# EAGLE design EE02CO2Sensor (EAGLE 7.6.0)
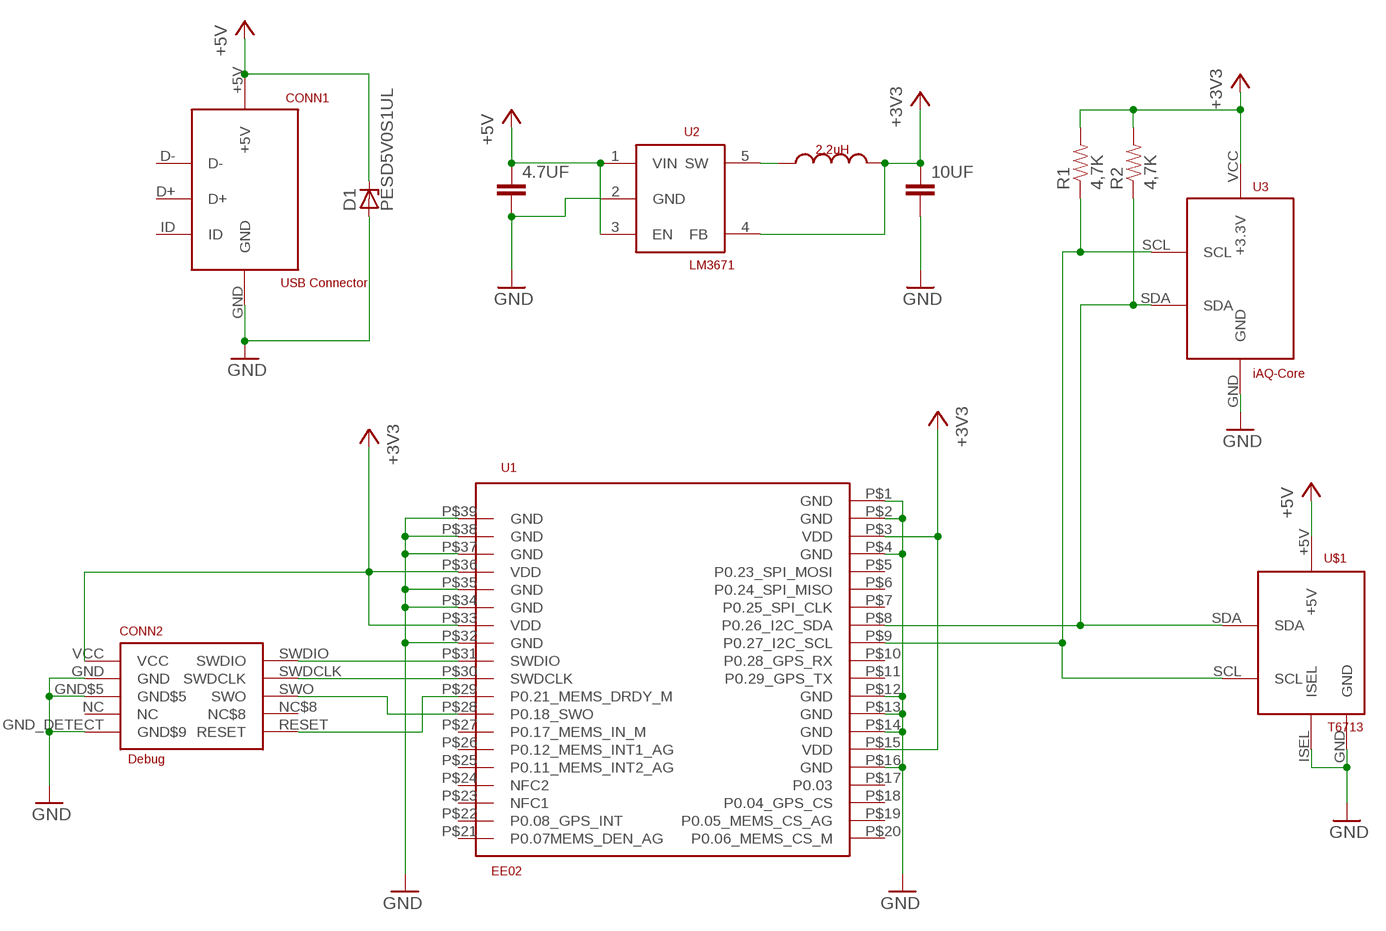
[diagram p0: schematic, sheet 1]

## Parts
4.7UF  4.7UF-0805  [0805]
10UF  10UF-1206  [1206]
CONN1  USB Connector  USB_MICRO_B  [USB_MICRO_B]
CONN2  Debug  DEBUGHEADER  [NRF52-P19-CONNECTOR]
D1  PESD5V0S1UL  [SOD882]
I1  2.2uH  2.2UH-INDUCTOR-1210  [1210]
R1  4,7K  510OHM1/4W1%(0805)  [0805]
R2  4,7K  510OHM1/4W1%(0805)  [0805]
U1  EE02  [EE02]
U2  LM3671  [SOT23-5L]
U3  iAQ-Core  IAQ-CORE  [IAQ-CORE]
U$1  T6713  T6713CO2  [T6713CO2]

## Nets
+3V3: 10UF.1 CONN2.VCC I1.2 R1.2 R2.2 U1.P$3(VDD) U1.P$15(VDD) U1.P$33(VDD) U1.P$36(VDD) U2.4(FB) U3.VCC(+3.3V)
+5V: 4.7UF.1 CONN1.+5V D1.CATHODE(C) U2.1(VIN) U2.3(EN) U$1.+5V
GND: 4.7UF.2 10UF.2 CONN1.GND CONN2.GND CONN2.GND$5 CONN2.GND_DETECT(GND$9) D1.ANODE(A) U1.P$1(GND) U1.P$2(GND) U1.P$4(GND) U1.P$12(GND) U1.P$13(GND) U1.P$14(GND) U1.P$16(GND) U1.P$32(GND) U1.P$34(GND) U1.P$35(GND) U1.P$37(GND) U1.P$38(GND) U1.P$39(GND) U2.2(GND) U3.GND U$1.GND U$1.ISEL
N$1: I1.1 U2.5(SW)
N$4: R2.1 U1.P$8(P0.26_I2C_SDA) U3.SDA U$1.SDA
N$5: R1.1 U1.P$9(P0.27_I2C_SCL) U3.SCL U$1.SCL
N$6: CONN2.SWDIO U1.P$31(SWDIO)
N$7: CONN2.SWO U1.P$28(P0.18_SWO)
N$8: CONN2.SWDCLK U1.P$30(SWDCLK)
N$9: CONN2.RESET U1.P$29(P0.21_MEMS_DRDY_M)
Unconnected: CONN1.D+ CONN1.D- CONN1.ID CONN2.NC CONN2.NC$8 U1.P$5(P0.23_SPI_MOSI) U1.P$6(P0.24_SPI_MISO) U1.P$7(P0.25_SPI_CLK) U1.P$10(P0.28_GPS_RX) U1.P$11(P0.29_GPS_TX) U1.P$17(P0.03) U1.P$18(P0.04_GPS_CS) U1.P$19(P0.05_MEMS_CS_AG) U1.P$20(P0.06_MEMS_CS_M) U1.P$21(P0.07MEMS_DEN_AG) U1.P$22(P0.08_GPS_INT) U1.P$23(NFC1) U1.P$24(NFC2) U1.P$25(P0.11_MEMS_INT2_AG) U1.P$26(P0.12_MEMS_INT1_AG) U1.P$27(P0.17_MEMS_IN_M)

## Library data of the parts
4.7UF = EE:4.7UF-0805
10UF = EE:10UF-1206: 10uF
CONN1 = EE:USB_MICRO_B
CONN2 = EE:DEBUGHEADER: DEBUG HEADER
D1 = EE:PESD5V0S1UL: Unidirectional ESD protection diode; VALE: PESD5V0S1UL
I1 = EE:2.2UH-INDUCTOR-1210
R1 R2 = EE:510OHM1/4W1%(0805): 510 Ohm; VALUE: 510 ohm
U1 = EE:EE02: EE02 Lora Module
U2 = EE:LM3671: LM3671 2-MHz, 600-mA Step-Down DC-DC Converter
U3 = EE:IAQ-CORE
U$1 = EE:T6713CO2

## Board
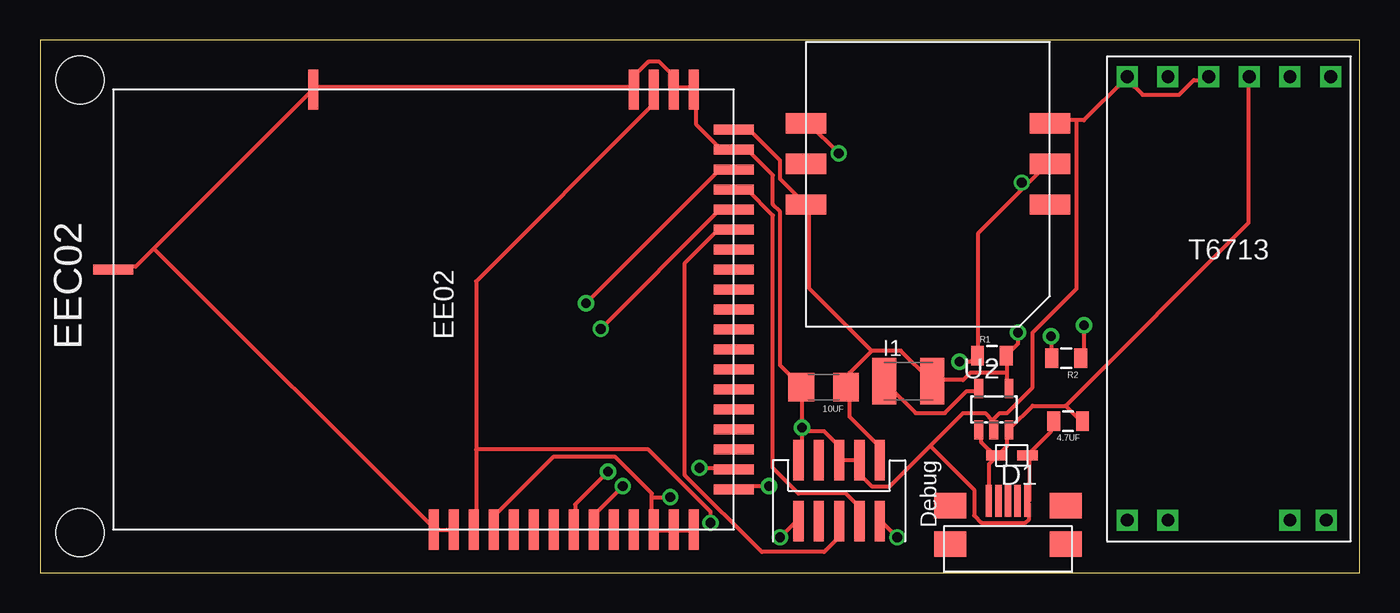
[diagram p1: board, top side]
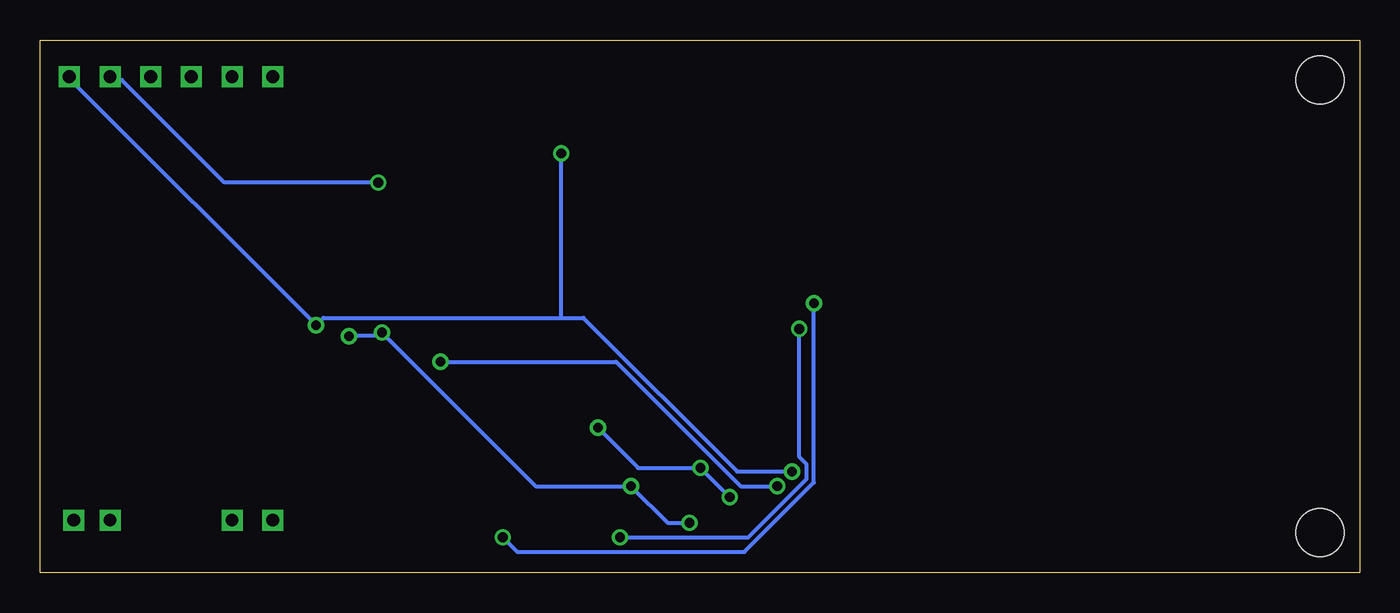
[diagram p2: board, bottom side, seen from below]

Size 82.41 x 33.28 mm. Coordinates in mm from the lower left corner, seen from the top.
Outline: 0,0 82.41,0 82.41,33.28 0,33.28 0,0
Copper layers (1*16): Top 0.035mm / dielectric 1.5mm / Bottom 0.035mm
Design rules "default": minimum track width 10mil, minimum drill 24mil, track to track 8mil, track to pad 8mil, pad to pad 8mil, via to via 8mil, smd to smd 8mil, copper to edge 40mil, drill to drill 8mil, minimum pad ring 10mil, minimum via ring 8mil, stop-mask expansion 4mil, vias tented up to drill 0mil, thermal gap 10mil
Holes 3 mm at 2.5,30.78 2.5,2.51

### Footprints (pad centres in the part's own frame; a part is rotated, then mirrored left to right if it is on the bottom)
0805 = smd 0.8 x 1.2: 1 -0.9,0; 2 0.9,0
1206 = smd 1.6 x 1.8: 1 -1.4,0; 2 1.4,0
USB_MICRO_B = smd 0.4 x 2: +5V -1.2,1.9; D+ 0,1.9; D- -0.6,1.9; GND 1.2,1.9; ID 0.6,1.9 | smd 2 x 1.6: P$7 -3.6,1.6; P$8 3.6,1.6; P$9 3.6,-0.8; P$10 -3.6,-0.8
NRF52-P19-CONNECTOR = smd 2.54 x 0.635: GND -15.24,10.16; GND$5 -15.24,8.89; GND_DETECT -15.24,6.35; NC -15.24,7.62; NC$8 -11.43,7.62; RESET -11.43,6.35; SWDCLK -11.43,10.16; SWDIO -11.43,11.43; SWO -11.43,8.89; VCC -15.24,11.43
SOD882 = smd 0.62 x 1.27: ANODE -1.95,-0.65; CATHODE -1.95,1.3
1210 = smd 1.5 x 2.9: 1 -1.5,0; 2 1.5,0
EE02 = smd 2.5 x 0.625: P$1 23.75,-10; P$2 23.75,-8.75; P$3 23.75,-7.5; P$4 23.75,-6.25; P$5 23.75,-5; P$6 23.75,-3.75; P$7 23.75,-2.5; P$8 23.75,-1.25; P$9 23.75,0; P$10 23.75,1.25; P$11 23.75,2.5; P$12 23.75,3.75; P$13 23.75,5; P$14 23.75,6.25; P$34 -3.75,6.25; P$35 -3.75,5; P$36 -3.75,3.75; P$37 -3.75,2.5; P$38 -3.75,-17.5 | smd 0.625 x 2.5: P$15 21.25,8.75; P$16 20,8.75; P$17 18.75,8.75; P$18 17.5,8.75; P$19 16.25,8.75; P$20 15,8.75; P$21 13.75,8.75; P$22 12.5,8.75; P$23 11.25,8.75; P$24 10,8.75; P$25 8.75,8.75; P$26 7.5,8.75; P$27 6.25,8.75; P$28 5,8.75; P$29 3.75,8.75; P$30 2.5,8.75; P$31 1.25,8.75; P$32 0,8.75; P$33 -1.25,8.75; P$39 7.5,-30
SOT23-5L = smd 0.55 x 1.2: 1 -0.95,-1.3; 2 0,-1.3; 3 0.95,-1.3; 4 0.95,1.3; 5 -0.95,1.3
IAQ-CORE = smd 2.54 x 1.27: GND -7.62,-3.81; NC -7.62,1.27; NC$2 7.62,-1.27; SCL -7.62,-1.27; SDA 7.62,-3.81; VCC 7.62,1.27
T6713CO2 = drill 0.8 square: +5V -12.7,0; GND -12.7,-2.54; ISEL -12.7,-7.62; P$1 15,4.8; P$2 15,2.54; P$3 15,-7.62; P$4 15,-5.08; PWMOUT -12.7,-5.08; SCL -12.7,2.54; SDA -12.7,5.08

### Placement (x,y rotation side)
4.7UF  64.19,9.47 180 top
10UF  48.93,11.59 180 top
CONN1  60.44,2.58 0 top
CONN2  41,-8.22 270 top
D1  61,9.28 90 top
I1  54.22,11.97 0 top
R1  59.43,13.55 0 top
R2  64.07,13.39 180 top
U1  34.57,26.44 270 top
U2  59.55,10.21 0 top
U3  55.44,24.27 180 top
U$1  75.5,18.28 270 top

### Tracks (layer width: path | path; a pad name or v marks a point on that pad's centre or on a via)
+3V3  (via drill 0.61)
  Top 0.254: 27.23,7.69 27.23,18.2 38.2,29.17 38.2,30.09 U1.P$36 | 27.23,7.69 27.23,2.89 U1.P$3 | U1.P$33 43.46,27.58 44.38,27.58 46.2,25.75 46.2,24.6 47.81,23 U3.VCC 48.03,22.77 48.03,17.75 51.92,13.86 | CONN2.VCC 52.38,7.23 52.38,7.91 50.55,9.74 50.55,11.57 10UF.1 50.55,11.8 50.55,12.49 51.92,13.86 | 60.38,12.49 60.38,11.57 U2.4 | 60.38,12.49 60.38,13.4 R1.2 60.38,13.63 61.06,14.32 v61.06,15 | v63.12,14.77 63.12,13.4 R2.2 | v45.52,5.4 43.46,5.4 U1.P$15 | 60.38,12.49 58.09,12.49 57.63,12.03 55.81,12.03 I1.2 55.58,12.03 53.75,13.86 51.92,13.86 | 27.23,7.69 37.98,7.69 41.86,3.8 v41.86,3.12
  Bottom 0.254: v63.12,14.77 61.29,14.77 v61.06,15 51.46,5.4 v45.52,5.4 43.23,3.12 v41.86,3.12
+5V
  Top 0.254: 59.69,7.23 58.78,8.14 58.78,8.83 U2.1 | 64.04,10.43 64.95,9.52 4.7UF.1 | 64.04,10.43 61.98,10.43 60.61,9.06 U2.3 60.38,8.83 60.38,7.91 59.92,7.46 D1.CATHODE 59.69,7.23 | 59.69,7.23 59.24,6.77 CONN1.+5V | 64.04,10.43 75.47,21.86 75.47,30.78 U$1.+5V
GND  (via drill 0.61)
  Top 0.254: U1.P$2 25.63,2.66 24.72,2.66 U1.P$1 24.49,2.89 7.12,20.26 | 7.12,20.26 16.95,30.09 U1.P$38 17.17,30.32 37.06,30.32 U1.P$37 37.29,30.32 37.29,31.23 37.98,31.92 38.66,31.92 39.35,31.23 39.35,30.32 U1.P$35 39.58,30.32 40.72,30.32 U1.P$34 40.95,30.09 40.95,28.03 42.32,26.66 43.23,26.66 U1.P$32 43.46,26.43 44.15,26.43 45.75,24.83 45.75,23 46.2,22.55 46.2,12.95 47.35,11.8 10UF.2 47.58,11.57 v47.58,9.06 47.58,8.83 | 7.12,20.26 5.97,19.12 4.6,19.12 U1.P$39 | 38.2,4.72 38.2,2.89 U1.P$12 38.43,2.66 39.35,2.66 U1.P$13 39.58,2.66 40.72,2.66 U1.P$14 | 38.2,4.72 38.2,4.94 35.92,7.23 32.03,7.23 28.38,3.57 28.38,2.89 U1.P$4 | v41.18,6.54 43.23,6.54 U1.P$16 | 38.2,4.72 v39.35,4.72 | 64.72,28.26 65.18,28.26 67.69,30.78 U$1.ISEL 67.92,30.78 68.84,29.86 71.12,29.86 72.04,30.78 72.95,30.78 U$1.GND | 64.72,28.26 63.12,28.26 U3.GND | 47.58,8.83 47.58,7.23 CONN2.GND_DETECT | 4.7UF.2 63.12,9.29 63.12,8.83 61.75,7.46 D1.ANODE 61.75,7.23 61.75,4.49 CONN1.GND 61.75,4.26 61.75,3.34 61.52,3.12 58.78,3.12 58.32,3.57 58.32,5.17 55.58,7.91 | 59.46,9.52 59.46,9.06 U2.2 | 59.46,9.52 59.01,9.97 57.63,9.97 55.58,7.91 | 55.58,7.91 53.06,5.4 51.92,5.4 51.23,6.09 51.23,7 CONN2.GND 51.01,7 50.09,7 CONN2.GND$5 49.86,7.23 49.86,7.91 48.95,8.83 47.58,8.83 | 64.72,28.26 64.72,17.75 61.98,15 61.98,11.57 60.38,9.97 59.92,9.97 59.46,9.52
  Bottom 0.254: v39.35,4.72 v41.18,6.54 45.06,6.54 v47.58,9.06
N$1
  Top 0.254: U2.5 58.55,11.34 57.86,11.34 56.49,9.97 54.66,9.97 52.84,11.8 I1.1
N$4  (via drill 0.61)
  Top 0.254: v65.18,15.46 65.18,13.4 R2.1 | v35.46,6.31 33.4,4.26 33.4,2.89 U1.P$8 | v49.86,26.2 48.03,28.03 U3.SDA
  Bottom 0.254: U$1.SDA 80.5,30.78 v65.18,15.46 64.72,15.92 49.86,15.92 | v35.46,6.31 38.89,6.31 48.49,15.92 49.86,15.92 | 49.86,15.92 v49.86,26.2
N$5  (via drill 0.61)
  Top 0.254: 61.52,24.15 62.89,25.52 U3.SCL | 61.52,24.15 58.55,21.17 58.55,13.63 R1.1 58.32,13.4 58.09,13.17 v57.41,13.17 | v36.38,5.4 34.77,3.8 34.77,2.89 U1.P$9 | 61.52,24.15 v61.29,24.38
  Bottom 0.254: v36.38,5.4 38.66,5.4 46.43,13.17 v57.41,13.17 | v61.29,24.38 70.89,24.38 77.3,30.78 77.98,30.78 U$1.SCL
N$6  (via drill 0.61)
  Top 0.254: v34.09,16.83 42.32,25.06 43.23,25.06 U1.P$31 | v53.52,2.2 52.61,3.12 CONN2.SWDIO
  Bottom 0.254: v34.09,16.83 34.09,5.63 38.43,1.29 52.61,1.29 v53.52,2.2
N$7
  Top 0.254: U1.P$28 43.23,21.4 42.32,21.4 40.26,19.34 40.26,6.09 45.06,1.29 48.95,1.29 49.86,2.2 49.86,3.12 CONN2.SWO
N$8
  Top 0.254: U1.P$30 43.46,23.92 44.15,23.92 45.75,22.32 45.75,6.54 47.35,4.94 50.32,4.94 51.01,4.26 51.01,3.34 CONN2.SWDCLK
N$9  (via drill 0.61)
  Top 0.254: v35,15.23 42.32,22.55 43.23,22.55 U1.P$29 | v46.2,2.2 47.35,3.34 CONN2.RESET
  Bottom 0.254: v35,15.23 35,7.23 34.55,6.77 34.55,5.86 38.2,2.2 v46.2,2.2

### Text on the board
tPlace: EEC02